# EAGLE design LC709203F_breakout (EAGLE 7.7.0)
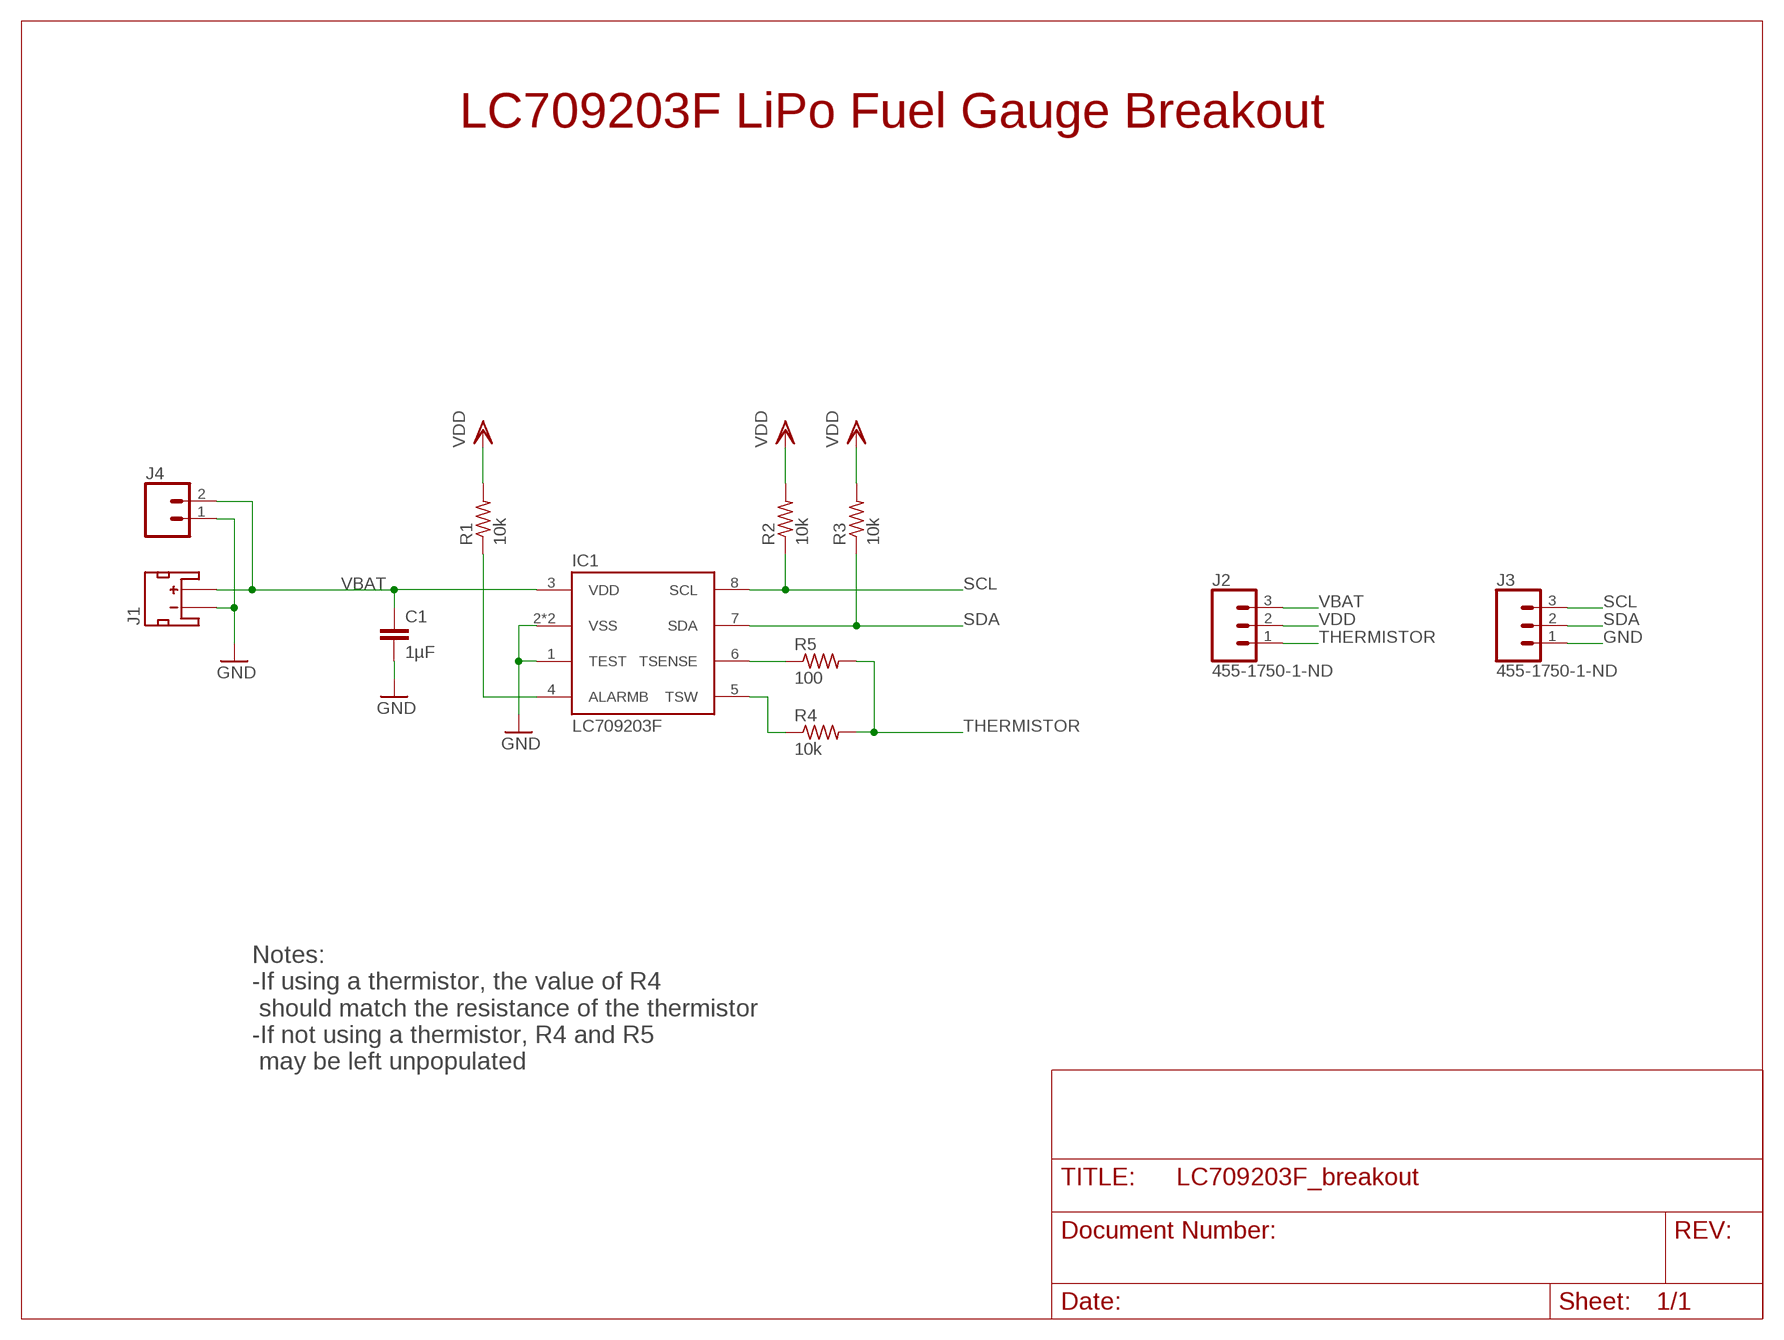
[diagram p0: schematic, sheet 1]

## Parts
C1  1µF  CAP_1UF_0805_MURATA_GRM  [C0805]
IC1  LC709203F  [WDFN8_ONSEMI]
J1  S2B-PH-SM4-TB  JST_2MM_MALE  [JST-2-SMD]
J2  455-1750-1-ND  CONN_03  [1X03]
J3  455-1750-1-ND  CONN_03  [1X03]
J4  CONN_02  [1X02]
R1  10k  RESISTOR_10K_0805_YAGEO_RC  [R0805]
R2  10k  RESISTOR_10K_0805_YAGEO_RC  [R0805]
R3  10k  RESISTOR_10K_0805_YAGEO_RC  [R0805]
R4  10k  RESISTOR_10K_0805_YAGEO_RC  [R0805]
R5  100  RESISTOR_100_0805_YAGEO_RC  [R0805]

## Nets
GND: C1.2 IC1.1(TEST) IC1.2(VSS) IC1.9(VSS) J1.1(-) J3.1 J4.1
N$1: IC1.4(ALARMB) R1.1
N$3: IC1.6(TSENSE) R5.1
N$4: IC1.5(TSW) R4.1
SCL: IC1.8(SCL) J3.3 R2.1
SDA: IC1.7(SDA) J3.2 R3.1
THERMISTOR: J2.1 R4.2 R5.2
VBAT: C1.1 IC1.3(VDD) J1.2(+) J2.3 J4.2
VDD: J2.2 R1.2 R2.2 R3.2
Unconnected: J1.NC1(PAD1) J1.NC2(PAD2)

## Notes on the sheet
- LC709203F LiPo Fuel Gauge Breakout
- Notes:
  -If using a thermistor, the value of R4
   should match the resistance of the thermistor
  -If not using a thermistor, R4 and R5
   may be left unpopulated

## Library data of the parts
C1 = parts:CAP*: Capacitor Ceramic capacitors; DESCRIPTION: CAP CER 1UF 10V X7R 0805; DIGIKEY#: 490-1695-1-ND; MANUFACTURER: Murata Electronics North America; PART#: GRM21BR71A105KA01L; TEMP_COEFFICIENT: X7R; TOLERANCE: ±10%; TYPE: MLCC; VOLTAGE: 10V
IC1 = parts:LC709203F: On Semiconductor LC709203F Smart LiB Gauge Battery Fuel Gauge LSI For 1‐Cell Lithium‐ion/Polymer (Li+); DESCRIPTION: IC BATT MONITOR LI-ION 8WDFN; DIGIKEY#: LC709203FQH-01TWGOSCT-ND; MANUFACTURER: ON Semiconductor; PART#: LC709203FQH-01TWG
J1 = parts:JST_2MM_MALE: JST 2MM MALE RA CONNECTOR; DESCRIPTION: CONN HEADER PH SIDE 2POS 2MM SMD; DIGIKEY#: 455-1749-1-ND; MANUFACTURER: JST Sales America Inc.; PART#: S2B-PH-SM4-TB(LF)(SN)
J2 J3 = SparkFun-Connectors:CONN_03: Multi connection point. Often used as Generic Header-pin footprint for 0.1 inch spaced/style header connections On any of the 0.1 inch spaced packages, you can populate with these: Break Away Headers - Straight <https://www.sparkfun.com/products/116> (PRT-00116) Break Away Male Headers - Right Angle <https://www.sparkfun.com/products/553> (PRT-00553) Female Headers <https://www.sparkfun.com/products/115> (PRT-00115) Break Away Headers - Machine Pin <https://www.sparkfun.com/products/117> (PRT-00117) Break Away Female Headers - Swiss Machine Pin <https://www.sparkfun.com/products/743> (PRT-00743) Stackable Header - 3 Pin (Female, 0.1") <https://www.sparkfun.com/products/13875> (PRT-13875) For SCREWTERMINALS and SPRING TERMINALS visit here: Screw Terimnals on SparkFun.com <https://www.sparkfun.com/search/results?term=Screw+Terminals> (5mm/3.5mm/2.54mm spacing) This device is also useful as a general connection point to wire up your design to another part of your project. Our various solder wires solder well into these plated through hole pads. Hook-Up Wire - Assortment (Stranded, 22 AWG) <https://www.sparkfun.com/products/11375> (PRT-11375) Hook-Up Wire - Assortment (Solid Core, 22 AWG) <https://www.sparkfun.com/products/11367> (PRT-11367) View the entire wire category on our website here <https://www.sparkfun.com/categories/141> Special notes: Molex polarized connector foot print use with SKU : PRT-08232 with associated crimp pins and housings.; PROD_ID: XXX-00000
J4 = SparkFun-Connectors:CONN_02: Multi connection point. Often used as Generic Header-pin footprint for 0.1 inch spaced/style header connections On any of the 0.1 inch spaced packages, you can populate with these: Break Away Headers - Straight <https://www.sparkfun.com/products/116> (PRT-00116) Break Away Male Headers - Right Angle <https://www.sparkfun.com/products/553> (PRT-00553) Female Headers <https://www.sparkfun.com/products/115> (PRT-00115) Break Away Headers - Machine Pin <https://www.sparkfun.com/products/117> (PRT-00117) Break Away Female Headers - Swiss Machine Pin <https://www.sparkfun.com/products/743> (PRT-00743) For SCREWTERMINALS and SPRING TERMINALS visit here: Screw Terimnals on SparkFun.com <https://www.sparkfun.com/search/results?term=Screw+Terminals> (5mm/3.5mm/2.54mm spacing) This device is also useful as a general connection point to wire up your design to another part of your project. Our various solder wires solder well into these plated through hole pads. Hook-Up Wire - Assortment (Stranded, 22 AWG) <https://www.sparkfun.com/products/11375> (PRT-11375) Hook-Up Wire - Assortment (Solid Core, 22 AWG) <https://www.sparkfun.com/products/11367> (PRT-11367) View the entire wire category on our website here <https://www.sparkfun.com/categories/141> Special notes: Molex polarized connector foot print use with: PRT-08233 with associated crimp pins and housings. 2.54_SCREWTERM for use with PRT-10571. 3.5mm Screw Terminal footprints for PRT-08084 5mm Screw Terminal footprints for use with PRT-08432
R1-R4 = parts:RESISTOR*: Resistors; DESCRIPTION: RES SMD 10K OHM 1% 1/8W 0805; DIGIKEY#: 311-10.0KCRCT-ND; MANUFACTURER: Yageo; PART#: RC0805FR-0710KL; POWER: 1/8W; TOLERANCE: ±1%
R5 = parts:RESISTOR*: Resistors; DESCRIPTION: RES SMD 100 OHM 1% 1/8W 0805; DIGIKEY#: 311-100CRCT-ND; MANUFACTURER: Yageo; PART#: RC0805FR-07100RL; POWER: 1/8W; TOLERANCE: ±1%

## Board
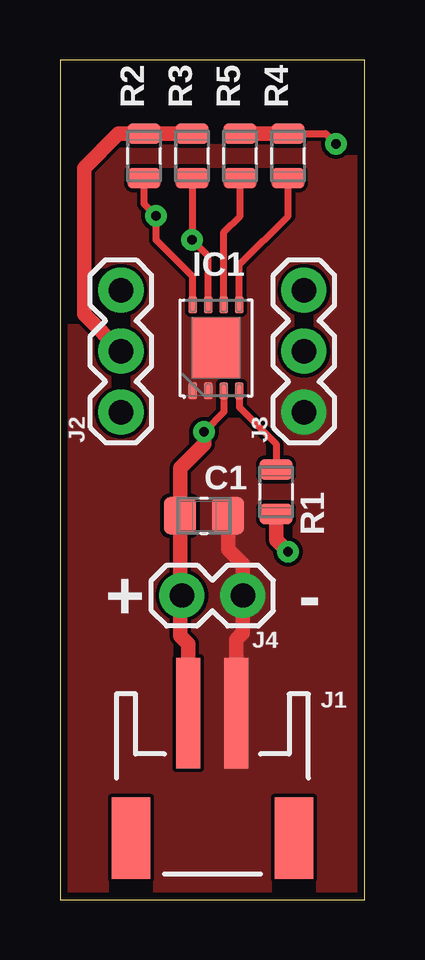
[diagram p1: board, top side]
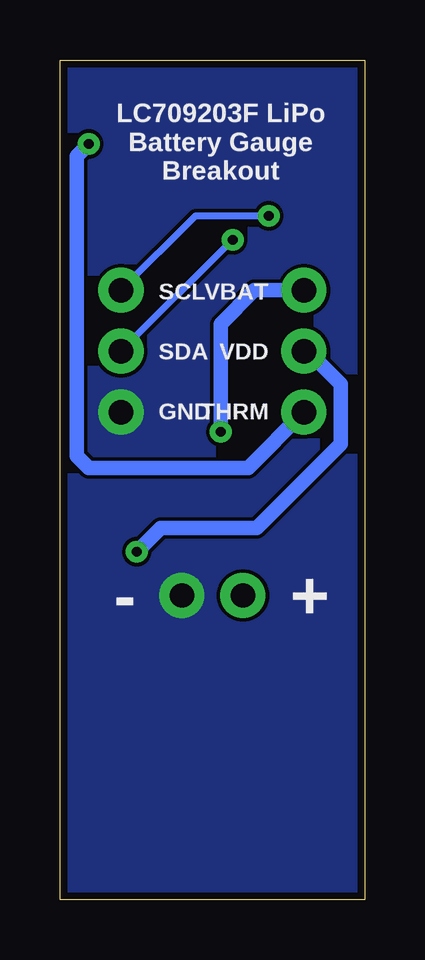
[diagram p2: board, bottom side, seen from below]

Size 12.7 x 35 mm. Coordinates in mm from the lower left corner, seen from the top.
Outline: 0,0 12.7,0 12.7,35 0,35 0,0
Copper layers (1*2*15*16): Top 0.04318125mm / dielectric 7.5mil / Route2 0.035559375mm / dielectric 40mil / Route15 0.035mm / dielectric 0.2mm / Bottom 0.04318125mm
Design rules "XXFXM-W000-Pentalogix *": minimum track width 8mil, minimum drill 8mil, track to track 6mil, track to pad 6mil, pad to pad 6mil, via to via 6mil, smd to smd 6mil, copper to edge 12mil, drill to drill 12mil, minimum pad ring 6mil, minimum via ring 10mil, stop-mask expansion 2mil, vias tented up to drill 25mil, thermal gap 10mil

### Footprints (pad centres in the part's own frame; a part is rotated, then mirrored left to right if it is on the bottom)
C0805 = smd 1.35 x 1.55: 1 -1,0; 2 1,0
WDFN8_ONSEMI = smd 0.35 x 0.7: 1 -0.975,-1.795; 2 -0.325,-1.795; 3 0.325,-1.795; 4 0.975,-1.795; 5 0.975,1.795; 6 0.325,1.795; 7 -0.325,1.795; 8 -0.975,1.795 | smd 1.96 x 2.56: 9 0,0
JST-2-SMD = smd 1 x 4.6: 1 -1,-3.7; 2 1,-3.7 | smd 1.6 x 3.4: NC1 -3.4,1.5; NC2 3.4,1.5
1X03 = drill 1.016 pad 1.88: 1 0,0; 2 2.54,0; 3 5.08,0
1X02 = drill 1.016 pad 1.88: 1 0,0; 2 2.54,0
R0805 = smd 0.87 x 1.38: 1 -0.93,0; 2 0.93,0

### Placement (x,y rotation side)
C1  6,16 0 top
IC1  6.5,23 0 top
J1  6.35,4.06 180 top
J2  2.54,20.32 90 top
J3  10.16,20.32 90 top
J4  7.62,12.68 180 top
R1  9,17 270 top
R2  3.5,31 90 top
R3  5.5,31 90 top
R4  9.5,31 90 top
R5  7.5,31 90 top

### Tracks (layer width: path | path; a pad name or v marks a point on that pad's centre or on a via)
GND
  Top 0.6: J1.1 7.35,10.85 7.62,11.12 J4.1 7.62,13.98 7,14.6 C1.2
  pour Bottom (no thermals): 0,35 12.7,35 12.7,0 0,0
  pour Top (no thermals): 0,35 12.7,35 12.7,0 0,0
N$1
  Top 0.3: IC1.4 7.47,20.52 9,19 R1.1
N$3
  Top 0.3: IC1.6 6.83,27.82 7.5,28.5 R5.1
N$4
  Top 0.3: IC1.5 7.47,26.48 9.5,28.5 R4.1
SCL  (via drill 0.4)
  Top 0.3: IC1.8 5.53,25.98 4,27.5 v4,28.5 3.5,29 R2.1
  Bottom 0.3: v4,28.5 7.06,28.5 J3.3
SDA  (via drill 0.4)
  Top 0.3: IC1.7 6.17,26.82 v5.5,27.5 R3.1
  Bottom 0.3: v5.5,27.5 5.52,27.5 J3.2
THERMISTOR  (via drill 0.4)
  Top 0.3: R4.2 11.07,31.93 v11.5,31.5
  Top 0.6: R5.2 R4.2
  Bottom 0.6: v11.5,31.5 12,31 12,18.5 11.5,18 4.86,18 J2.1
VBAT  (via drill 0.4)
  Top 0.3: IC1.3 6.83,20.32 v6,19.5
  Top 0.6: C1.1 5,18 6,19 v6,19.5 | 4.71,15.71 C1.1 | J1.2 5.35,10.65 5,11 5,12.6 J4.2 5,12.76 C1.1
  Bottom 0.6: J2.3 4.6,25.4 6,24 v6,19.5
VDD  (via drill 0.4)
  Top 0.6: R3.2 R2.2 2.43,31.93 1,30.5 1,24.4 J2.2 | R1.2 9,15 v9.5,14.5
  Bottom 0.6: v9.5,14.5 8.5,15.5 4.5,15.5 1,19 1,21.5 2,22.5 2.18,22.5 J2.2

### Text on the board
tPlace: + | -
bPlace: LC709203F LiPo / Battery Gauge / Breakout | VBAT | SCL | VDD | SDA | THRM | GND | + | -